# EAGLE schematic ESP-RGB (EAGLE 9.6.2)
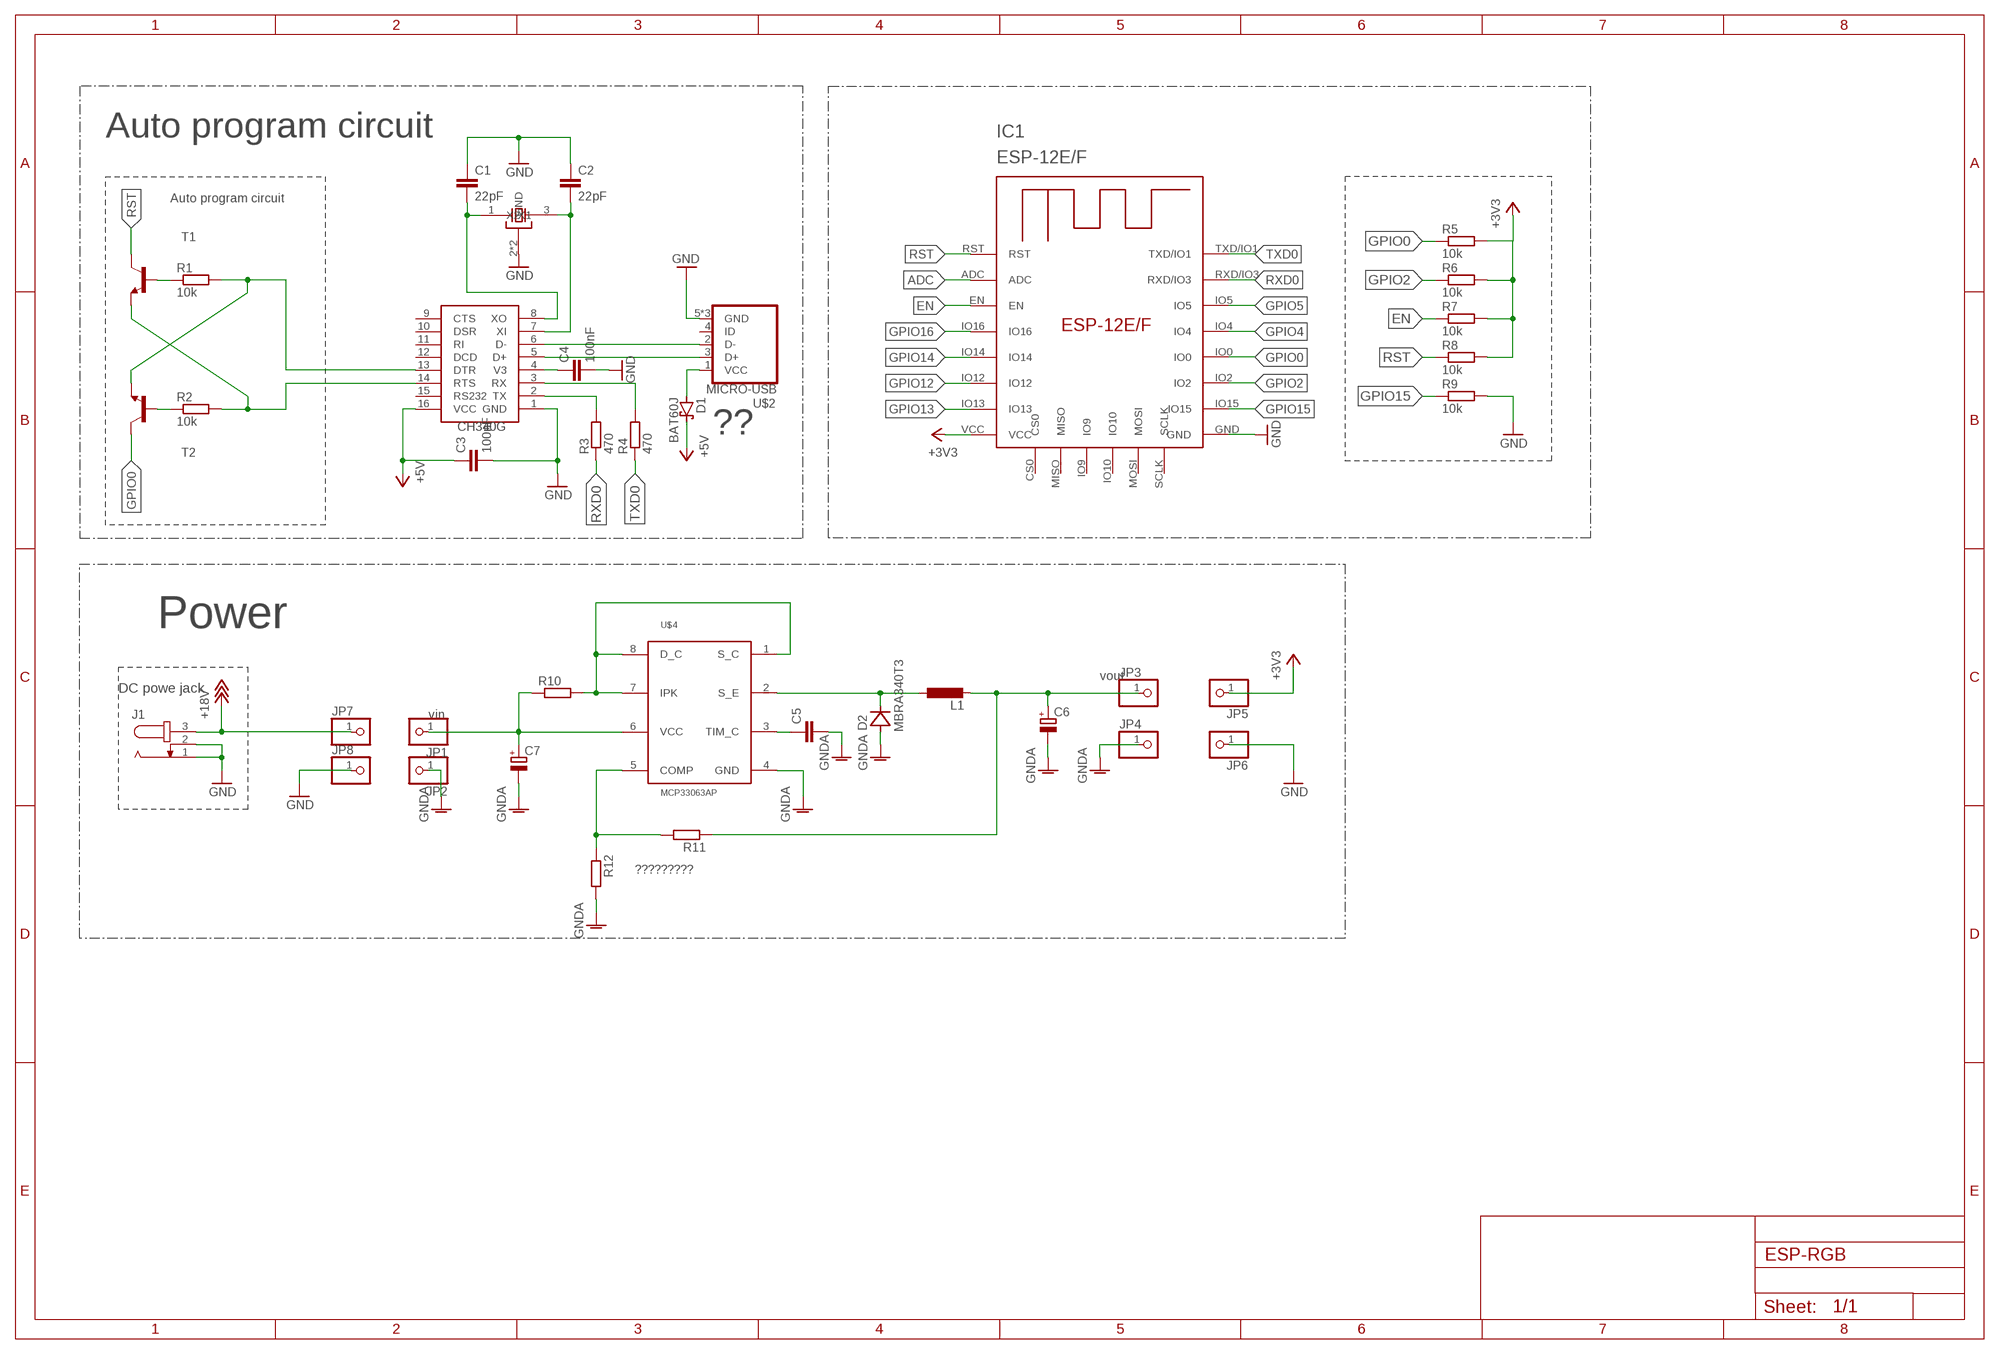
[diagram p0: schematic, sheet 1]

## Parts
C1  22pF  C-EUC0805K  [C0805K]
C2  22pF  C-EUC0805K  [C0805K]
C3  100nF  C-EUC0805K  [C0805K]
C4  100nF  C-EUC0805K  [C0805K]
C5  C-EUC0805K  [C0805K]
C6  CPOL-EU153CLV-0505  [153CLV-0505]
C7  CPOL-EU153CLV-0505  [153CLV-0505]
D1  BAT60J  [SOD323_ST]
D2  MBRA340T3  [SMA]
IC1  ESP-12E/F  [ESP-12E]
J1  JACK-PLUG0  [SPC4077]
JP1  PINHD-1X1  [1X01]
JP2  PINHD-1X1  [1X01]
JP3  PINHD-1X1  [1X01]
JP4  PINHD-1X1  [1X01]
JP5  PINHD-1X1  [1X01]
JP6  PINHD-1X1  [1X01]
JP7  PINHD-1X1  [1X01]
JP8  PINHD-1X1  [1X01]
L1  L-EUPIS2816  [PIS2816]
R1  10k  R-EU_R0603  [R0603]
R2  10k  R-EU_R0603  [R0603]
R3  470  R-EU_R0603  [R0603]
R4  470  R-EU_R0603  [R0603]
R5  10k  R-EU_R0603  [R0603]
R6  10k  R-EU_R0603  [R0603]
R7  10k  R-EU_R0603  [R0603]
R8  10k  R-EU_R0603  [R0603]
R9  10k  R-EU_R0603  [R0603]
R10  R-EU_R1206W  [R1206W]
R11  R-EU_R0603  [R0603]
R12  R-EU_R0603  [R0603]
T1  BC817-16-NPN-SOT23-BEC  [SOT23-BEC]
T2  BC817-16-NPN-SOT23-BEC  [SOT23-BEC]
U$1  CH340G  [SOIC16]
U$2  MICRO-USB  [MICRO-USB]
U$3  CTS_32X25_SMD  [CTS_32X25]
U$4  MCP33063AP  [DIL08]

## Nets
+3V3: IC1.VCC JP5.1 R5.2 R6.2 R7.2 R8.2
+5V: C3.1 D1.C U$1.16(VCC)
+18V: J1.3 JP7.1
ADC: IC1.ADC
EN: IC1.EN R7.1
GND: C1.1 C2.1 C3.2 C4.2 IC1.GND J1.1 J1.2 JP6.1 JP8.1 R9.2 U$1.1(GND) U$2.5(GND) U$2.GND1(GND) U$2.GND2(GND) U$3.2(GND) U$3.4(GND)
GNDA: C5.2 C6.- C7.- D2.A JP2.1 JP4.1 R12.2 U$4.4(GND)
GPIO0: IC1.IO0 R5.1 T2.C
GPIO2: IC1.IO2 R6.1
GPIO4: IC1.IO4
GPIO5: IC1.IO5
GPIO12: IC1.IO12
GPIO13: IC1.IO13
GPIO14: IC1.IO14
GPIO15: IC1.IO15 R9.1
GPIO16: IC1.IO16
N$1: R2.2 T1.E U$1.14(RTS)
N$2: R1.2 T2.E U$1.13(DTR)
N$3: R1.1 T1.B
N$4: R2.1 T2.B
N$5: U$1.6(D-) U$2.2(D-)
N$6: U$1.5(D+) U$2.3(D+)
N$7: D1.A U$2.1(VCC)
N$8: C7.+ JP1.1 R10.1 U$4.6(VCC)
N$9: R3.2 U$1.2(TX)
N$10: C1.2 U$1.8(XO) U$3.1(X1)
N$11: C2.2 U$1.7(XI) U$3.3(X2)
N$12: R4.2 U$1.3(RX)
N$13: C4.1 U$1.4(V3)
N$15: R11.2 R12.1 U$4.5(COMP)
N$16: R10.2 U$4.1(S_C) U$4.7(IPK) U$4.8(D_C)
N$17: D2.C L1.1 U$4.2(S_E)
N$19: C5.1 U$4.3(TIM_C)
N$21: C6.+ JP3.1 L1.2 R11.1
RST: IC1.RST R8.1 T1.C
RXD0: IC1.RXD/IO3 R3.1
TXD0: IC1.TXD/IO1 R4.1
Unconnected: IC1.CS0 IC1.IO9 IC1.IO10 IC1.MISO IC1.MOSI IC1.SCLK U$1.9(CTS) U$1.10(DSR) U$1.11(RI) U$1.12(DCD) U$1.15(RS232) U$2.4(ID)

## Notes on the sheet
- Auto program circuit
- Auto program circuit
- ??
- Power
- vout
- DC powe jack
- vin
- ?????????

## Library data of the parts
C1-C5 = rcl:C-EU: CAPACITOR, European symbol; SPICEPREFIX: C
C6 C7 = rcl:CPOL-EU: POLARIZED CAPACITOR, European symbol; SPICEPREFIX: C
D1 = diode:BAT60J: Schottky barrier diode Source: www.st.com, BAT60J.pdf
D2 = diode:MBRA340T3: Surface Mount Schottky Power Rectifier Source: http://www.onsemi.com/pub_link/Collateral/MBRA340T3-D.PDF
IC1 = ESP-RGB:ESP-12E/F
J1 = con-jack:JACK-PLUG: DC POWER JACK Power Jack, DC, Right Angle, Through Hole, Rated 5A at 16VDC, PC Terminals Distributor: Farnell (www.Farnell.de) Drawing: 84N1161.pdf / 84N1162.pdf Manufacturer: SPC Technology (www.spctechnology.com) Type: SPC4077 / SPC 4078; OC_FARNELL: unknown; OC_NEWARK: unknown
JP1-JP8 = pinhead:PINHD-1X1: PIN HEADER
L1 = rcl:L-EU: INDUCTOR, European symbol; SPICEPREFIX: L
R1-R12 = rcl:R-EU_: RESISTOR, European symbol; SPICEPREFIX: R
T1 T2 = transistor:*-NPN-: NPN Transistror BF959 corrected 2008.03.06
U$1 = ESP-RGB:CH340G
U$2 = ESP-RGB:MICRO-USB: Micro USB B connector
U$3 = ESP-RGB:CTS_32X25_SMD
U$4 = ESP-RGB:MCP33063AP